# EAGLE schematic 16ch_hiroseadapter (EAGLE 7.2.0)
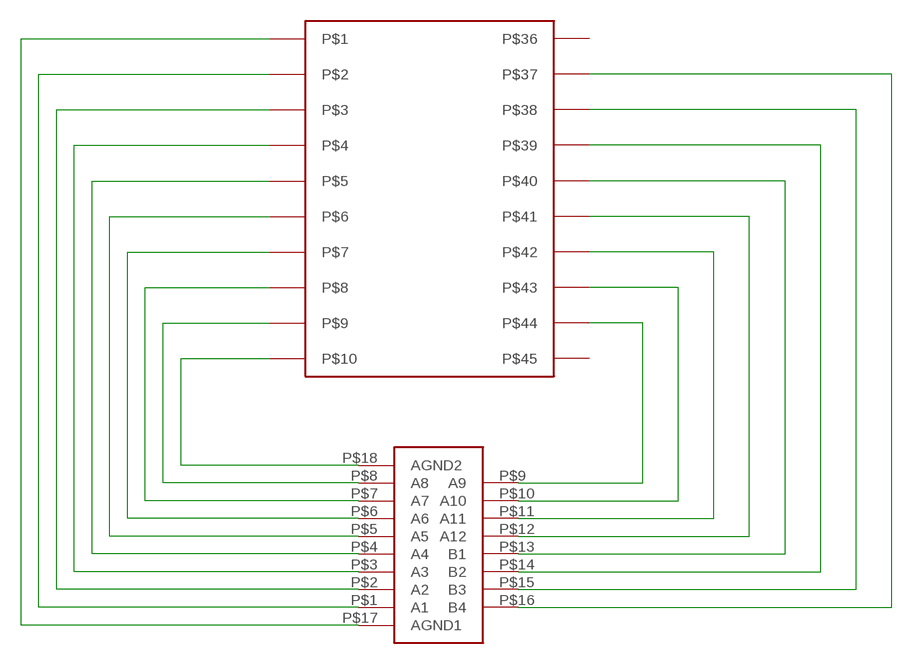
[diagram p0: schematic, sheet 1]

## Parts
U$1  HIROSE_DF40_70PIN  [HIROSE_DF40C-70DS]
U$2  OMNETICS_FE18  [OMNETICS_FE18]

## Nets
N$1: U$1.P$10 U$2.P$18(AGND2)
N$2: U$1.P$9 U$2.P$8(A8)
N$3: U$1.P$8 U$2.P$7(A7)
N$4: U$1.P$7 U$2.P$6(A6)
N$5: U$1.P$6 U$2.P$5(A5)
N$6: U$1.P$5 U$2.P$4(A4)
N$7: U$1.P$4 U$2.P$3(A3)
N$8: U$1.P$3 U$2.P$2(A2)
N$9: U$1.P$2 U$2.P$1(A1)
N$10: U$1.P$1 U$2.P$17(AGND1)
N$11: U$1.P$44 U$2.P$9(A9)
N$12: U$1.P$43 U$2.P$10(A10)
N$13: U$1.P$42 U$2.P$11(A11)
N$14: U$1.P$41 U$2.P$12(A12)
N$15: U$1.P$40 U$2.P$13(B1)
N$16: U$1.P$39 U$2.P$14(B2)
N$17: U$1.P$38 U$2.P$15(B3)
N$18: U$1.P$37 U$2.P$16(B4)
Unconnected: U$1.P$36 U$1.P$45

## Library data of the parts
U$1 = GG_hirose20:HIROSE_DF40_70PIN
U$2 = connectors:OMNETICS_FE18